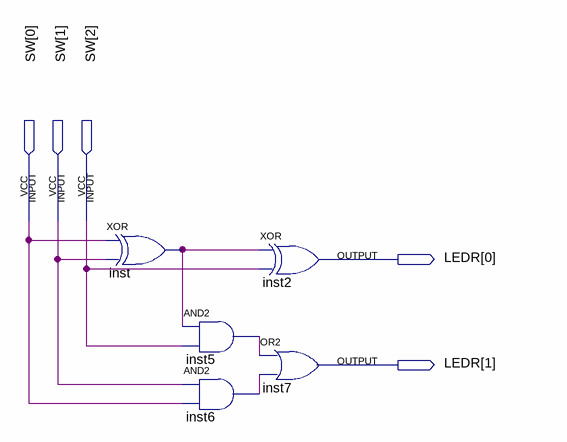
[diagram p0: schematic sheet]
// Quartus schematic BinaryAdder.bdf as structural Verilog: 5 symbols, 5 pins
module BinaryAdder (
  input  [2:0] SW,
  output [1:0] LEDR
);

  wire inst5_out, inst6_out, inst_out;

  xor inst (inst_out, SW[0], SW[1]);
  and inst5 (inst5_out, inst_out, SW[2]);
  and inst6 (inst6_out, SW[1], SW[0]);
  xor inst2 (LEDR[0], inst_out, SW[2]);
  or inst7 (LEDR[1], inst5_out, inst6_out);
endmodule
